# Altium project ePBR23_ACU_Power.PrjPCB (part 2 of 2)
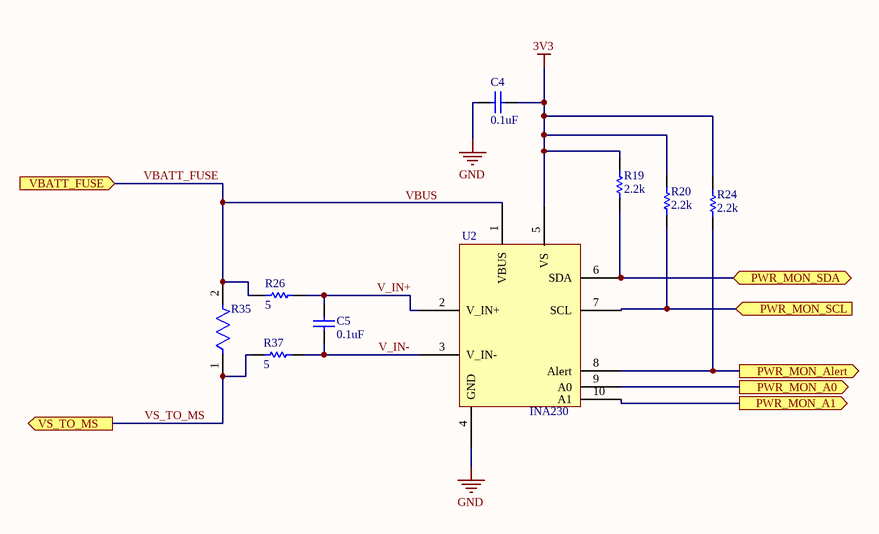
[diagram p6: 2  - Power Switch.SchDoc]

## Nets that join several sheets
3V3: 1  - Connectors (5 pins), 8  - Voltage Conversions Delays (C12.2 R28.1 R29.2 U1.3), 2  - Power Switch (5 pins)
5V: 1  - Connectors (CON2.B4 CON2.B7 L2.2), 3  - Fuses (F15.1), 8  - Voltage Conversions Delays (C15.2 R30.1 R31.2 U2#1.3)
ACU_PWR: 1  - Connectors (CON1.A7 CON2.A8 L1.1), 3  - Fuses (ACU_PWR1.1 D2.1 F10.3 F10.4), 6  - Load Drivers (Q2.3), 8  - Voltage Conversions Delays (6 pins)
GLV: 3  - Fuses (20 pins), 6  - Load Drivers (11 pins), 9  - UV OV Protection (C20.1 Q4.2)
GND: 1  - Connectors (27 pins), 3  - Fuses (17 pins), 6  - Load Drivers (21 pins), 8  - Voltage Conversions Delays (12 pins), 9  - UV OV Protection (9 pins), 2  - Power Switch (C4#2.2 U2#2.4)
ACC_FAN_CTRL: 1  - Connectors (CN1.21), 6  - Load Drivers (R23.1)
ACC_FAN_PWR: 3  - Fuses (D10.1 F9.3 F9.4), 6  - Load Drivers (C8.2 C9.2 LD4.3)
ACC_FAN_PWR_IN: 1  - Connectors (CN1.3), 6  - Load Drivers (LD4.1 LD4.5 R25.1)
AMS_PWR: 1  - Connectors (CN1.5), 3  - Fuses (D3.1 F2.3 F2.4)
BRAKE_PWR: 1  - Connectors (CN2.16), 3  - Fuses (D9.1 F8.3 F8.4)
BSPD_TEST: 1  - Connectors (CN1.1), 3  - Fuses (J1.1)
BUZR_CTRL: 1  - Connectors (CON1.A5), 6  - Load Drivers (LD2.3)
BUZR_FB: 1  - Connectors (CON2.B5), 6  - Load Drivers (LD2.4)
BUZR_FUSE: 3  - Fuses (F1.1 F1.2), 6  - Load Drivers (LD2.10 LD2.11 R19#1.1)
BUZR_PWR: 1  - Connectors (CN2.25), 3  - Fuses (D1.1 F1.3 F1.4)
EMETER_PWR: 1  - Connectors (CN1.6), 3  - Fuses (D8.1 F7.3 F7.4)
FANS_CTRL: 1  - Connectors (CON1.B7), 6  - Load Drivers (LD1.3)
FANS_FB: 1  - Connectors (CON2.B6), 6  - Load Drivers (LD1.4)
FANS_FUSE: 3  - Fuses (F6.1 F6.2), 6  - Load Drivers (6 pins)
FANS_PWR: 1  - Connectors (CN2.31), 3  - Fuses (D7.1 F6.3 F6.4)
HCP_SENS_PWR: 1  - Connectors (CN1.24), 3  - Fuses (D15.1 F15.2)
HVB_PWR: 1  - Connectors (CN1.2), 3  - Fuses (D14.1 F14.3 F14.4)
IMD_PWR: 1  - Connectors (CN1.27), 3  - Fuses (D5.1 F4.3 F4.4)
MC_PWR: 1  - Connectors (CN2.27), 3  - Fuses (D12.1 F12.3 F12.4)
MC_PWR_CTRL: 1  - Connectors (CON1.A2), 6  - Load Drivers (LD2.6)
MC_PWR_FB: 1  - Connectors (CON2.A5), 6  - Load Drivers (LD2.5)
MC_PWR_FUSE: 3  - Fuses (F12.1 F12.2), 6  - Load Drivers (LD2.8 LD2.9 R20#1.1)
PUMP_CTRL: 1  - Connectors (CON1.B6), 6  - Load Drivers (LD3.3)
PUMP_FB: 1  - Connectors (CON2.A9), 6  - Load Drivers (LD3.4)
PUMP_FUSE: 3  - Fuses (F3.1 F3.2), 6  - Load Drivers (6 pins)
PUMP_PWR: 1  - Connectors (CN2.34), 3  - Fuses (D4.1 F3.3 F3.4)
STATUS_LIGHT_PWR: 1  - Connectors (CN2.26), 3  - Fuses (D11.1 F11.3 F11.4)
VBATT_FUSE: 1  - Connectors (CN1.36), 3  - Fuses (D13.1 F13.3 F13.4), 9  - UV OV Protection (R48.1)
VBATT_RAW: 1  - Connectors (WM1.1), 3  - Fuses (C1.1 F13.1 F13.2)
VCU_PWR: 1  - Connectors (CN2.13), 3  - Fuses (D6.1 F5.3 F5.4)